# EAGLE design fejlesztő (EAGLE 6.5.0)
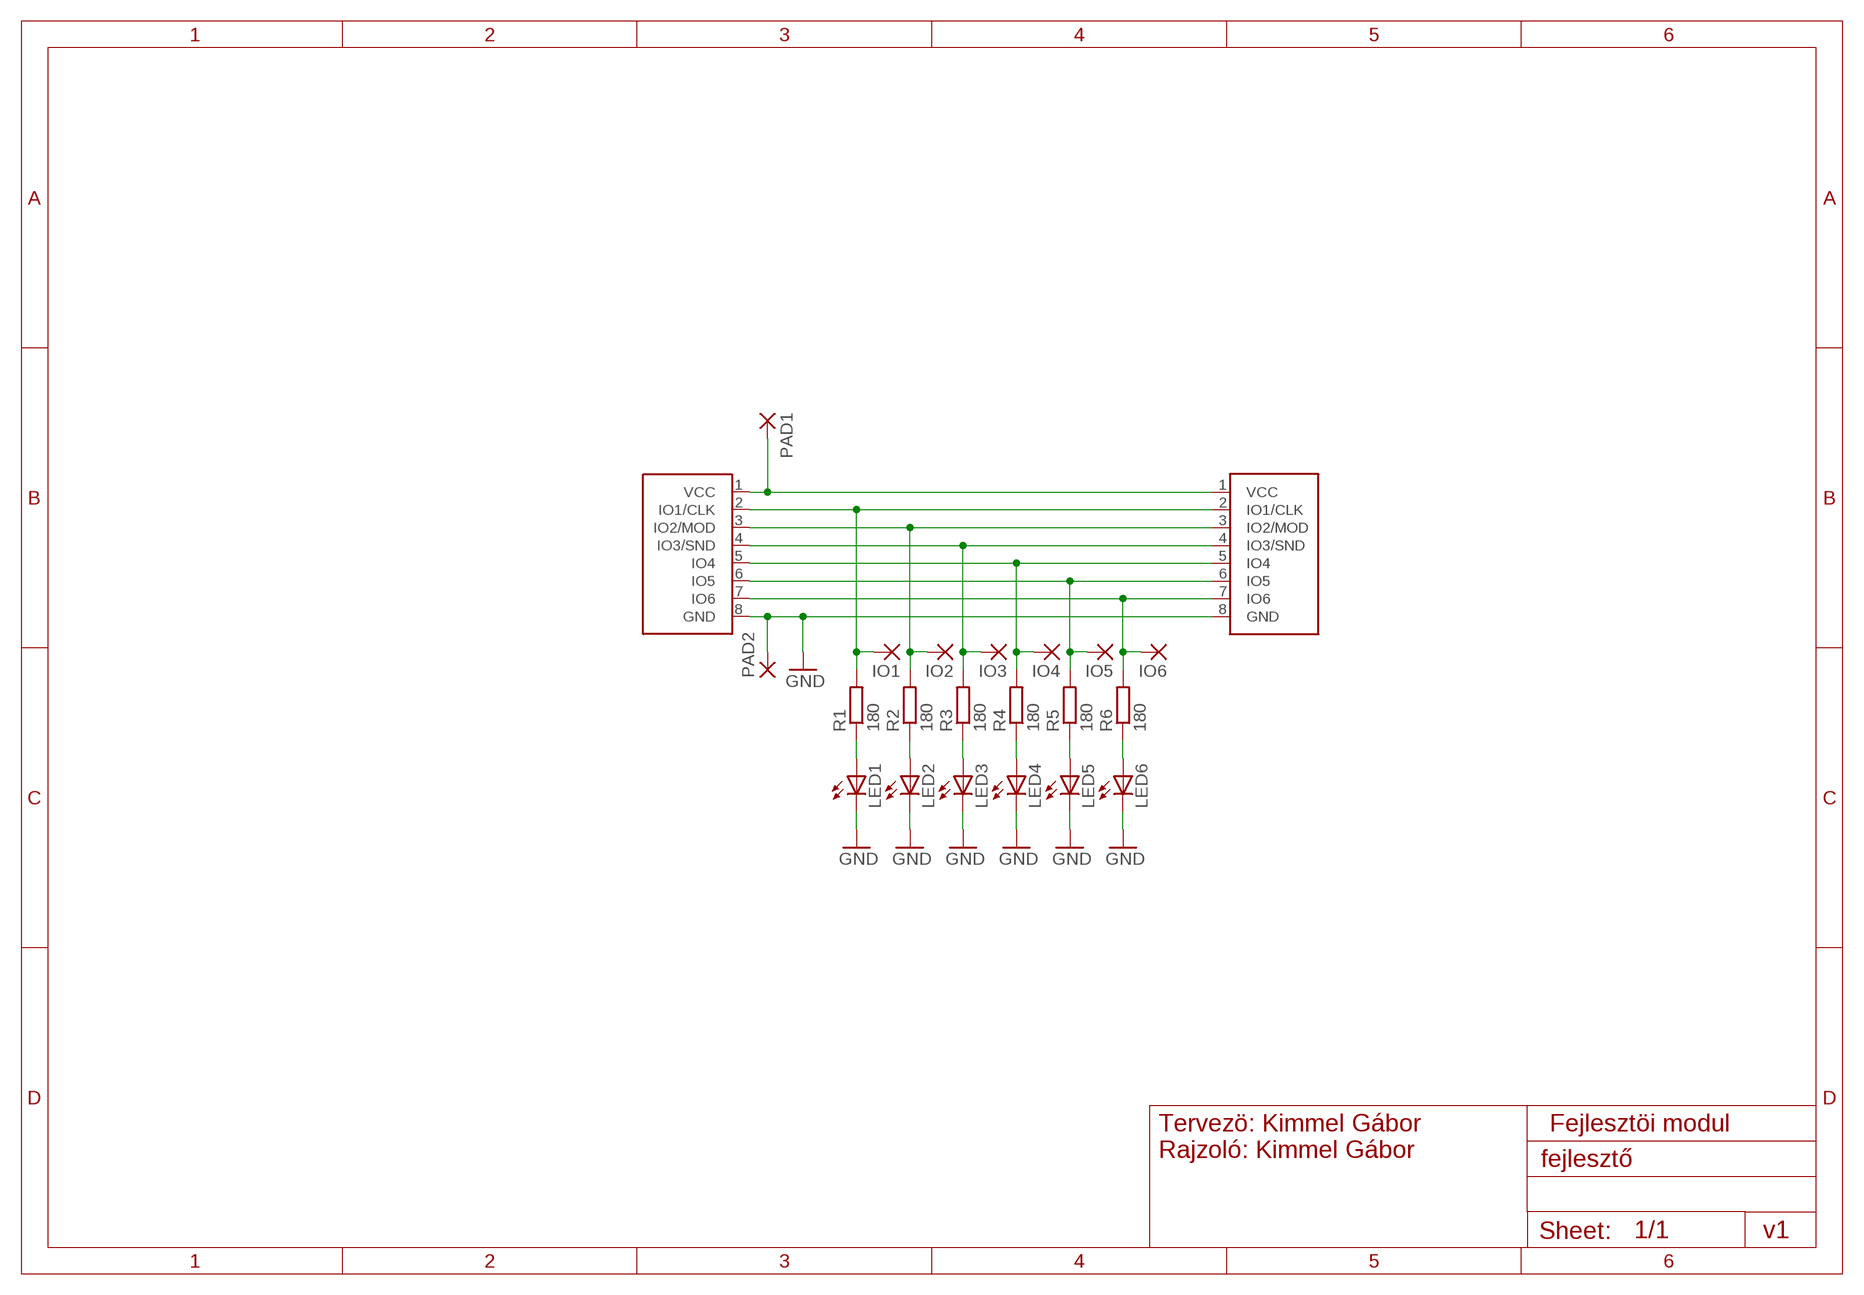
[diagram p0: schematic, sheet 1]

## Parts
IO1  2,15/1,0  [2,15/1,0]
IO2  2,15/1,0  [2,15/1,0]
IO3  2,15/1,0  [2,15/1,0]
IO4  2,15/1,0  [2,15/1,0]
IO5  2,15/1,0  [2,15/1,0]
IO6  2,15/1,0  [2,15/1,0]
LED1  LED5MM  [LED5MM]
LED2  LED5MM  [LED5MM]
LED3  LED5MM  [LED5MM]
LED4  LED5MM  [LED5MM]
LED5  LED5MM  [LED5MM]
LED6  LED5MM  [LED5MM]
PAD1  3,17/1,1  [3,17/1,1]
PAD2  3,17/1,1  [3,17/1,1]
R1  180  R-EU_0207/10  [0207/10]
R2  180  R-EU_0207/10  [0207/10]
R3  180  R-EU_0207/10  [0207/10]
R4  180  R-EU_0207/10  [0207/10]
R5  180  R-EU_0207/10  [0207/10]
R6  180  R-EU_0207/10  [0207/10]
U$1  GANZ-CONNECTOR  [FE08W]
U$2  GANZ-CONNECTOR-OUT  [MA08-1W]

## Nets
GND: LED1.K(C) LED2.K(C) LED3.K(C) LED4.K(C) LED5.K(C) LED6.K(C) PAD2.1(P) U$1.8(GND) U$2.8(GND)
N$1: PAD1.1(P) U$1.1(VCC) U$2.1(VCC)
N$9: LED1.A R1.1
N$10: IO1.1(P) R1.2 U$1.2(IO1/CLK) U$2.2(IO1/CLK)
N$11: LED2.A R2.1
N$12: IO2.1(P) R2.2 U$1.3(IO2/MOD) U$2.3(IO2/MOD)
N$13: LED3.A R3.1
N$14: IO3.1(P) R3.2 U$1.4(IO3/SND) U$2.4(IO3/SND)
N$15: LED4.A R4.1
N$16: IO4.1(P) R4.2 U$1.5(IO4) U$2.5(IO4)
N$17: LED5.A R5.1
N$18: IO5.1(P) R5.2 U$1.6(IO5) U$2.6(IO5)
N$19: LED6.A R6.1
N$20: IO6.1(P) R6.2 U$1.7(IO6) U$2.7(IO6)

## Notes on the sheet
- Tervezö: Kimmel Gábor
  Rajzoló: Kimmel Gábor
- Fejlesztöi modul
- v1

## Library data of the parts
IO1-IO6 = wirepad:2,15/1,0: THROUGH-HOLE PAD
LED1-LED6 = led:LED: LED OSRAM: - CHIPLED LG R971, LG N971, LY N971, LG Q971, LY Q971, LO R971, LY R971 LH N974, LH R974 LS Q976, LO Q976, LY Q976 LO Q996 - Hyper CHIPLED LW Q18S LB Q993, LB Q99A, LB R99A - SideLED LS A670, LO A670, LY A670, LG A670, LP A670 LB A673, LV A673, LT A673, LW A673 LH A674 LY A675 LS A676, LA A676, LO A676, LY A676, LW A676 LS A679, LY A679, LG A679 - Hyper Micro SIDELED® LS Y876, LA Y876, LO Y876, LY Y876 LT Y87S - SmartLED LW L88C, LW L88S LB L89C, LB L89S, LG L890 LS L89K, LO L89K, LY L89K LS L896, LA L896, LO L896, LY L896 - TOPLED LS T670, LO T670, LY T670, LG T670, LP T670 LSG T670, LSP T670, LSY T670, LOP T670, LYG T670 LG T671, LOG T671, LSG T671 LB T673, LV T673, LT T673, LW T673 LH T674 LS T676, LA T676, LO T676, LY T676, LB T676, LH T676, LSB T676, LW T676 LB T67C, LV T67C, LT T67C, LS T67K, LO T67K, LY T67K, LW E67C LS E67B, LA E67B, LO E67B, LY E67B, LB E67C, LV E67C, LT E67C LW T67C LS T679, LY T679, LG T679 LS T770, LO T770, LY T770, LG T770, LP T770 LB T773, LV T773, LT T773, LW T773 LH T774 LS E675, LA E675, LY E675, LS T675 LS T776, LA T776, LO T776, LY T776, LB T776 LHGB T686 LT T68C, LB T68C - Hyper Mini TOPLED® LB M676 - Mini TOPLED Santana® LG M470 LS M47K, LO M47K, LY M47K Source: http://www.osram.convergy.de LUXEON: - LUMILED® LXK2-PW12-R00, LXK2-PW12-S00, LXK2-PW14-U00, LXK2-PW14-V00 LXK2-PM12-R00, LXK2-PM12-S00, LXK2-PM14-U00 LXK2-PE12-Q00, LXK2-PE12-R00, LXK2-PE12-S00, LXK2-PE14-T00, LXK2-PE14-U00 LXK2-PB12-K00, LXK2-PB12-L00, LXK2-PB12-M00, LXK2-PB14-N00, LXK2-PB14-P00, LXK2-PB14-Q00 LXK2-PR12-L00, LXK2-PR12-M00, LXK2-PR14-Q00, LXK2-PR14-R00 LXK2-PD12-Q00, LXK2-PD12-R00, LXK2-PD12-S00 LXK2-PH12-R00, LXK2-PH12-S00 LXK2-PL12-P00, LXK2-PL12-Q00, LXK2-PL12-R00 Source: www.luxeon.com KINGBRIGHT: KA-3528ASYC Source: www.kingbright.com
PAD1 PAD2 = wirepad:3,17/1,1: THROUGH-HOLE PAD
R1-R6 = resistor:R-EU_: RESISTOR, European symbol
U$1 = ganzlib:GANZ-CONNECTOR
U$2 = ganzlib:GANZ-CONNECTOR-OUT

## Board
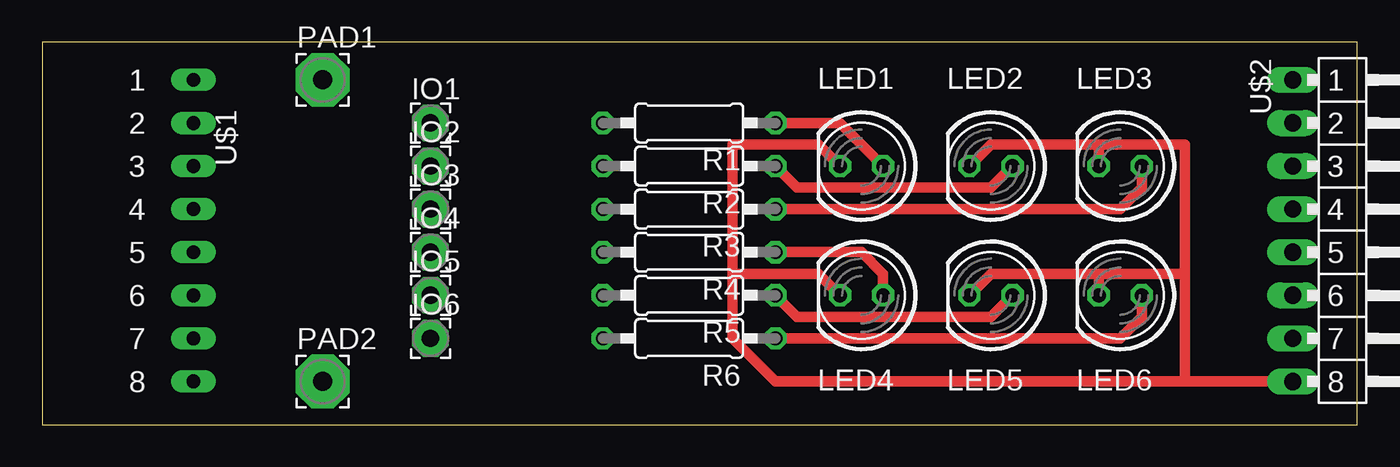
[diagram p1: board, top side]
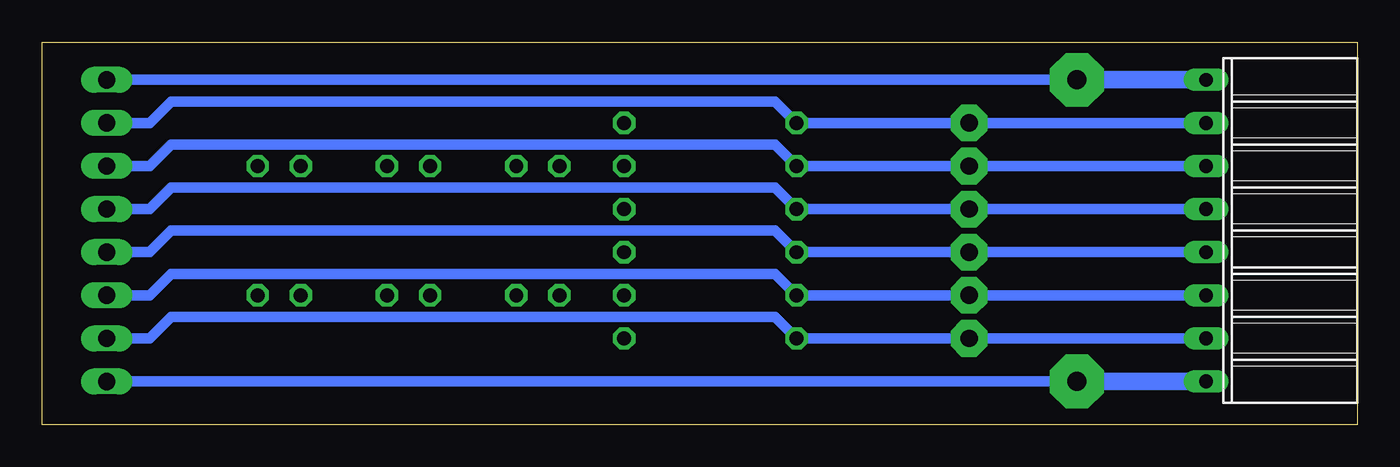
[diagram p2: board, bottom side, seen from below]

Size 77.45 x 22.53 mm. Coordinates in mm from the lower left corner, seen from the top.
Outline: 0,0 77.45,0 77.45,22.53 0,22.53 0,0
Copper layers (1*16): Top 0.035mm / dielectric 1.5mm / Bottom 0.035mm
Design rules "default": minimum track width 10mil, minimum drill 24mil, track to track 8mil, track to pad 8mil, pad to pad 8mil, via to via 8mil, smd to smd 8mil, copper to edge 40mil, drill to drill 8mil, minimum pad ring 10mil, minimum via ring 8mil, stop-mask expansion 4mil, vias tented up to drill 0mil, thermal gap 10mil

### Footprints (pad centres in the part's own frame; a part is rotated, then mirrored left to right if it is on the bottom)
2,15/1,0 = drill 1.016 pad 2.159 octagon: 1 0,0
LED5MM = drill 0.813 octagon: A -1.27,0; K 1.27,0
3,17/1,1 = drill 1.118 pad 3.175 octagon: 1 0,0
0207/10 = drill 0.813 octagon: 1 -5.08,0; 2 5.08,0
FE08W = drill 0.813 long: 1 0,8.89; 2 0,6.35; 3 0,3.81; 4 0,1.27; 5 0,-1.27; 6 0,-3.81; 7 0,-6.35; 8 0,-8.89
MA08-1W = drill 1.016 long: 1 0,8.89; 2 0,6.35; 3 0,3.81; 4 0,1.27; 5 0,-1.27; 6 0,-3.81; 7 0,-6.35; 8 0,-8.89

### Placement (x,y rotation side)
IO1  22.86,17.78 0 top
IO2  22.86,15.24 0 top
IO3  22.86,12.7 0 top
IO4  22.86,10.16 0 top
IO5  22.86,7.62 0 top
IO6  22.86,5.08 0 top
LED1  48.26,15.24 180 top
LED2  55.88,15.24 180 top
LED3  63.5,15.24 180 top
LED4  48.26,7.62 180 top
LED5  55.88,7.62 180 top
LED6  63.5,7.62 180 top
PAD1  16.51,20.32 0 top
PAD2  16.51,2.54 0 top
R1  38.1,17.78 180 top
R2  38.1,15.24 180 top
R3  38.1,12.7 180 top
R4  38.1,10.16 180 top
R5  38.1,7.62 180 top
R6  38.1,5.08 180 top
U$1  8.89,11.43 0 top
U$2  73.66,11.43 0 top

### Tracks (layer width: path | path; a pad name or v marks a point on that pad's centre or on a via)
GND
  Top 0.61: 62.23,16.51 55.88,16.51 LED2.K | 62.23,16.51 LED3.K | LED5.K 55.88,8.89 62.23,8.89 | 62.23,8.89 LED6.K | LED4.K 45.72,8.89 40.64,8.89 | LED1.K 45.72,16.51 40.64,16.51 40.64,8.89 | U$2.8 67.31,2.54 | 67.31,2.54 43.18,2.54 40.64,5.08 40.64,8.89 | 62.23,8.89 67.31,8.89 | 67.31,8.89 67.31,16.51 62.23,16.51 | 67.31,8.89 67.31,2.54
  Bottom 0.61: PAD2.1 U$2.8
  Bottom 1.016: U$1.8 PAD2.1
N$1
  Bottom 0.61: PAD1.1 U$2.1
  Bottom 1.016: PAD1.1 U$1.1
N$9
  Top 0.61: R1.1 46.99,17.78 LED1.A
N$10
  Bottom 0.61: U$1.2 IO1.1 R1.2 34.29,19.05 69.85,19.05 71.12,17.78 U$2.2
N$11
  Top 0.61: R2.1 44.45,13.97 55.88,13.97 LED2.A
N$12
  Bottom 0.61: U$1.3 IO2.1 R2.2 34.29,16.51 69.85,16.51 71.12,15.24 U$2.3
N$13
  Top 0.61: R3.1 63.5,12.7 64.77,13.97 LED3.A
N$14
  Bottom 0.61: U$1.4 IO3.1 R3.2 34.29,13.97 69.85,13.97 71.12,12.7 U$2.4
N$15
  Top 0.61: R4.1 48.26,10.16 49.53,8.89 LED4.A
N$16
  Bottom 0.61: U$1.5 IO4.1 R4.2 34.29,11.43 69.85,11.43 71.12,10.16 U$2.5
N$17
  Top 0.61: R5.1 44.45,6.35 55.88,6.35 LED5.A
N$18
  Bottom 0.61: U$1.6 IO5.1 R5.2 34.29,8.89 69.85,8.89 71.12,7.62 U$2.6
N$19
  Top 0.61: R6.1 63.5,5.08 64.77,6.35 LED6.A
N$20
  Bottom 0.61: U$1.7 IO6.1 R6.2 34.29,6.35 69.85,6.35 71.12,5.08 U$2.7